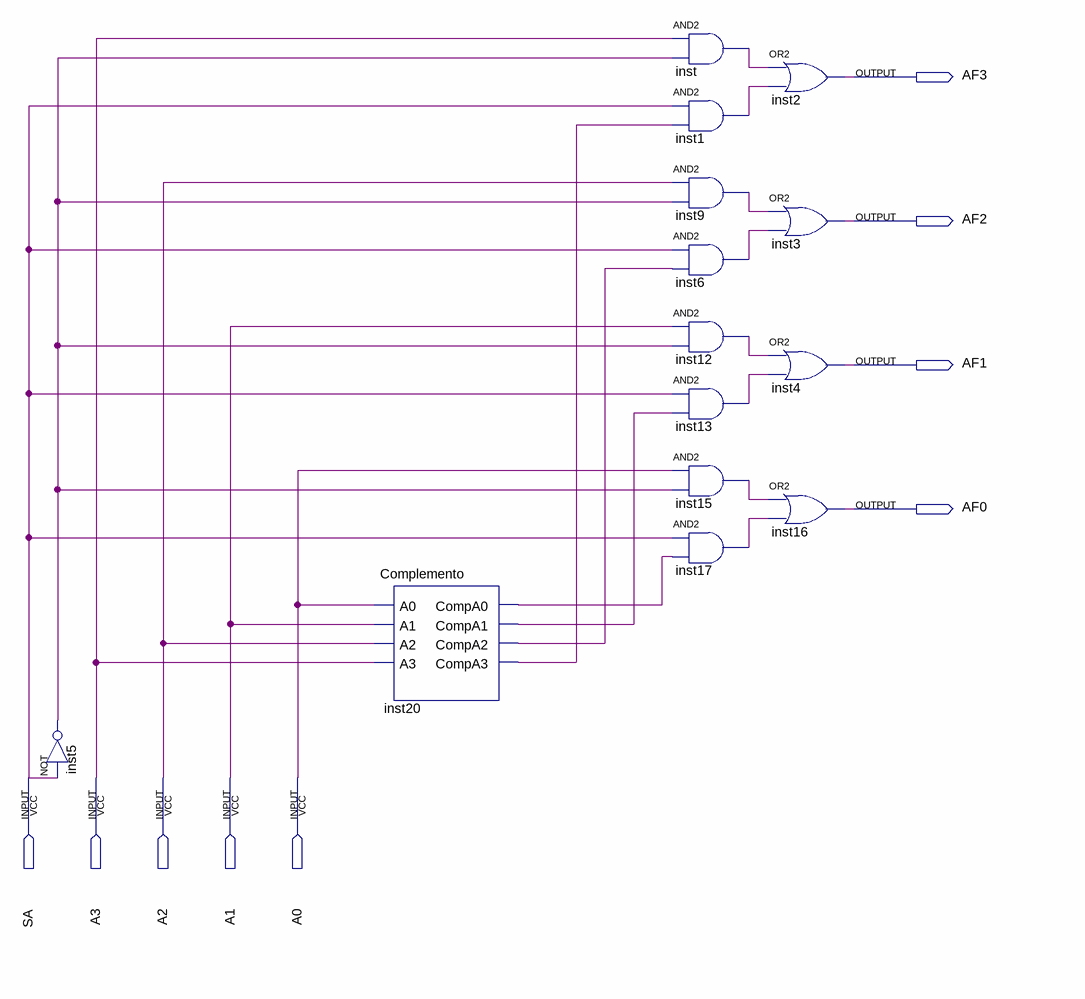
[diagram p0: schematic sheet]
// Quartus schematic DEC_SI.bdf as structural Verilog: 14 symbols, 9 pins
module DEC_SI (
  input  SA,
  input  A3,
  input  A2,
  input  A1,
  input  A0,
  output AF3,
  output AF2,
  output AF1,
  output AF0
);

  wire inst1_out, inst5_out, inst6_out, inst9_out, inst12_out, inst13_out, inst15_out, inst17_out,
       inst20_compa0, inst20_compa1, inst20_compa2, inst20_compa3, inst_out;

  not inst5 (inst5_out, SA);
  Complemento inst20 (
    .A0(A0), .A1(A1), .A2(A2), .A3(A3), .CompA0(inst20_compa0), .CompA1(inst20_compa1),
    .CompA2(inst20_compa2), .CompA3(inst20_compa3));
  and inst (inst_out, A3, inst5_out);
  and inst1 (inst1_out, SA, inst20_compa3);
  and inst9 (inst9_out, A2, inst5_out);
  and inst6 (inst6_out, SA, inst20_compa2);
  and inst12 (inst12_out, A1, inst5_out);
  and inst13 (inst13_out, SA, inst20_compa1);
  and inst15 (inst15_out, A0, inst5_out);
  and inst17 (inst17_out, SA, inst20_compa0);
  or inst2 (AF3, inst_out, inst1_out);
  or inst3 (AF2, inst9_out, inst6_out);
  or inst4 (AF1, inst12_out, inst13_out);
  or inst16 (AF0, inst15_out, inst17_out);
endmodule
